# Altium project VM03.PrjPcb
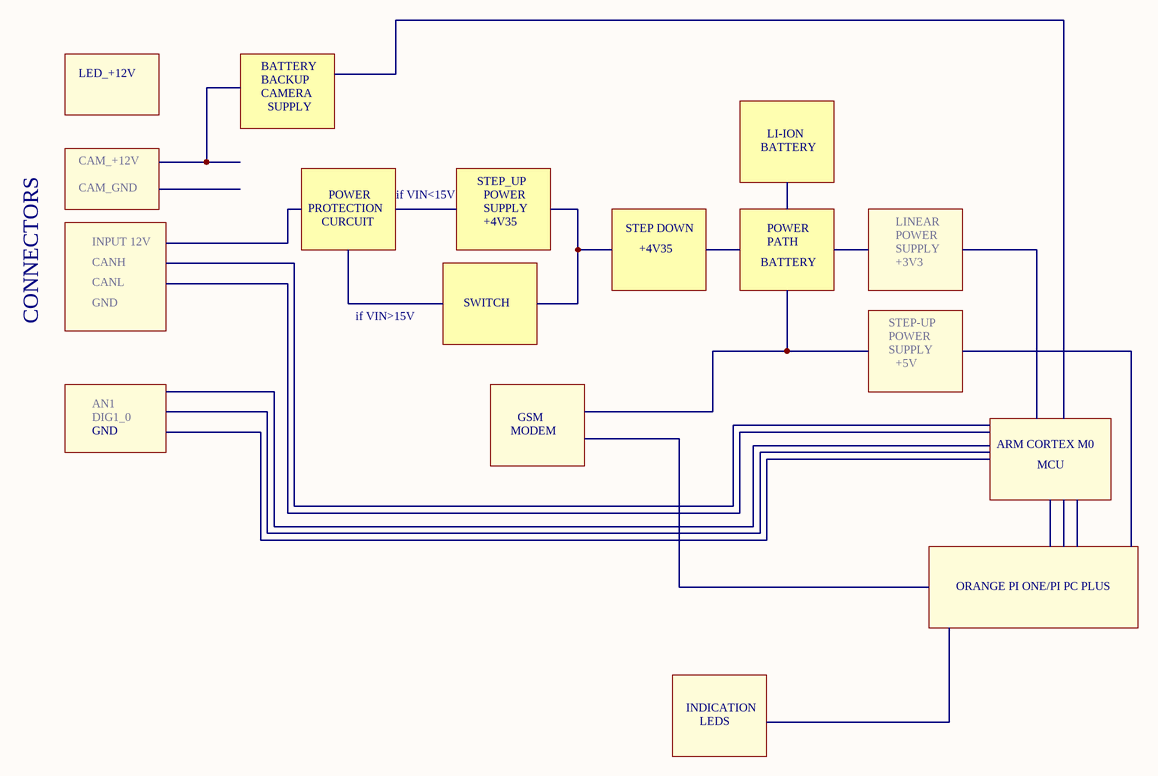
[diagram p0: [2]-BLOCK_DIAGRAM.SchDoc]
13 sheets, 186 parts. Net scope: flat (ports and power ports of the same name join across sheets).
Board file: VM03.PcbDoc
Sheets:
  [2]-BLOCK_DIAGRAM.SchDoc
  [3]-MCU_MAIN.SchDoc
  [4]-MCU_POWER.SchDoc
  [5]-OPI_MAIN.SchDoc
  [7]-GSM_MODEM_MAIN.SchDoc
  [9]-CAMERA_POWER_CONTROLLER.SchDoc
  [10]-MAIN_POWER.SchDoc
  [11]-MAIN_POWER2.SchDoc
  [11]-BATTERY_BACKUP.SchDoc
  [12]-MCU_INPUTS.SchDoc
  [13]-LED_INDICATION.SchDoc
  [14]-MAIN_CONNECTORS.SchDoc
  [16]-CLOCK.SchDoc

## Sheet [2]-BLOCK_DIAGRAM.SchDoc
size A4

### Notes on the sheet
- LED_+12V
- BATTERY
- BACKUP
- CAMERA
- CAM_+12V
- SUPPLY
- LI-ION
- CAM_GND
- PROTECTION
- CURCUIT
- POWER
- if VIN<15V
- STEP_UP
- +4V35
- STEP DOWN
- LINEAR
- INPUT 12V
- CANH
- CANL
- PATH
- +3V3
- CONNECTORS
- GND
- if VIN>15V
- SWITCH
- STEP-UP
- +5V
- AN1
- DIG1_0
- MODEM
- GSM
- ARM CORTEX M0
- MCU
- ORANGE PI ONE/PI PC PLUS
- INDICATION
- LEDS

## Sheet [3]-MCU_MAIN.SchDoc
size A4
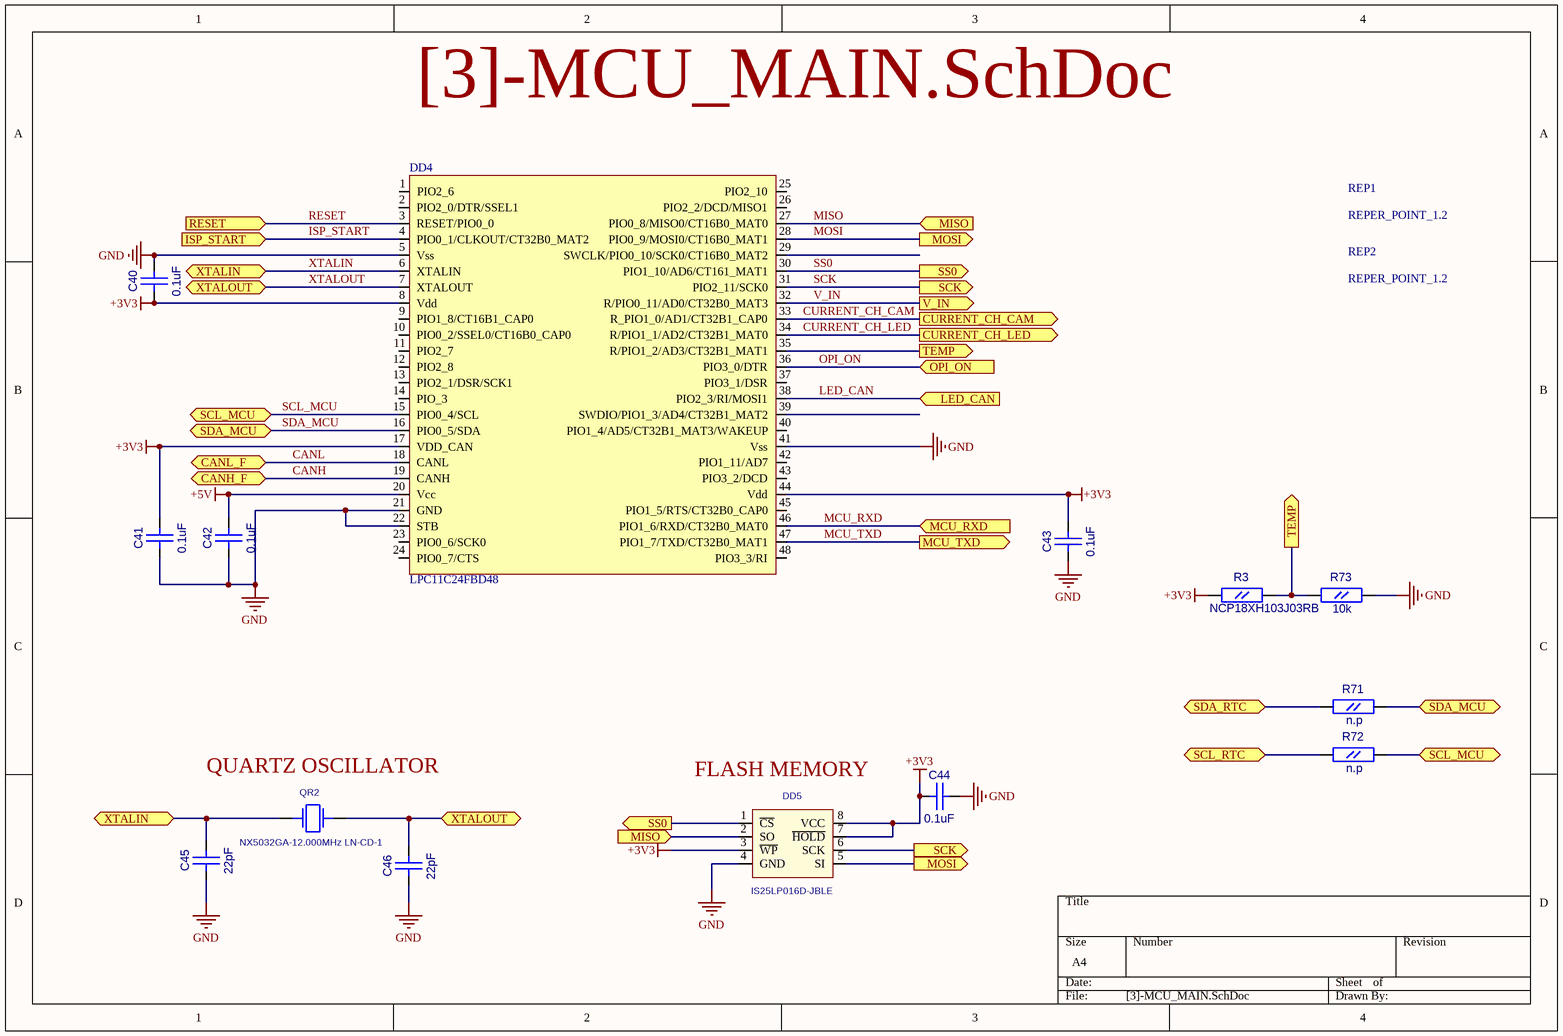
[diagram p1: [3]-MCU_MAIN.SchDoc]

### Parts
C40  0.1uF  [CC0603]
C41  0.1uF  [CC0603]
C42  0.1uF  [CC0603]
C43  0.1uF  [CC0603]
C44  0.1uF  [CC0603]
C45  22pF  [CC0603]
C46  22pF  [CC0603]
DD4  LPC11C24FBD48  [LQFP48]
DD5  IS25LP016D-JBLE  [EIAJ_SO8]
QR2  NX5032GA-12.000MHz LN-CD-1  [AC5032_2]
R3  NCP18XH103J03RB  [RC0603]
R71  n.p  [RC0603]
R72  n.p  [RC0603]
R73  10k  [RC0603]
REP1  REPER_POINT_1.2  [REPER1.2]
REP2  REPER_POINT_1.2  [REPER1.2]

### Ports
CANH_F (bidir), CANL_F (bidir), CURRENT_CH_CAM (out), CURRENT_CH_LED (out), ISP_START (in), LED_CAN (in), MCU_RXD (in), MCU_TXD (out), MISO (in), MOSI (out), OPI_ON (in), RESET (in), SCK (out), SCL_MCU (bidir), SCL_RTC (bidir), SDA_MCU (bidir), SDA_RTC (bidir), SS0 (out), TEMP (out), V_IN (out), XTALIN (bidir), XTALOUT (bidir)

### Nets
+3V3: C40.1(A) C41.2(B) C43.2(B) C44.1(A) DD4.8(Vdd) DD4.17(VDD_CAN) DD4.44(Vdd) DD5.3(~{WP}) DD5.7(~{HOLD}) DD5.8(VCC) R3.1(A)
+5V: C42.2(B) DD4.20(Vcc)
GND: C40.2(B) C41.1(A) C42.1(A) C43.1(A) C44.2(B) C45.1(A) C46.1(A) DD4.5(Vss) DD4.21(GND) DD4.22(STB) DD4.41(Vss) DD5.4(GND) R73.2(B)
CANH: DD4.19(CANH) ; port CANH_F
CANL: DD4.18(CANL) ; port CANL_F
CURRENT_CH_CAM: DD4.33(R_PIO1_0/AD1/CT32B1_CAP0) ; port CURRENT_CH_CAM
CURRENT_CH_LED: DD4.34(R/PIO1_1/AD2/CT32B1_MAT0) ; port CURRENT_CH_LED
ISP_START: DD4.4(PIO0_1/CLKOUT/CT32B0_MAT2) ; port ISP_START
LED_CAN: DD4.38(PIO2_3/RI/MOSI1) ; port LED_CAN
MCU_RXD: DD4.46(PIO1_6/RXD/CT32B0_MAT0) ; port MCU_RXD
MCU_TXD: DD4.47(PIO1_7/TXD/CT32B0_MAT1) ; port MCU_TXD
MISO: DD4.27(PIO0_8/MISO0/CT16B0_MAT0) DD5.2(SO) ; port MISO
MOSI: DD4.28(PIO0_9/MOSI0/CT16B0_MAT1) DD5.5(SI) ; port MOSI
OPI_ON: DD4.36(PIO3_0/DTR) ; port OPI_ON
RESET: DD4.3(RESET/PIO0_0) ; port RESET
SCK: DD4.31(PIO2_11/SCK0) DD5.6(SCK) ; port SCK
SCL_MCU: DD4.15(PIO0_4/SCL) R72.2(B) ; port SCL_MCU
SDA_MCU: DD4.16(PIO0_5/SDA) R71.2(B) ; port SDA_MCU
SS0: DD4.30(PIO1_10/AD6/CT161_MAT1) DD5.1(~{CS}) ; port SS0
V_IN: DD4.32(R/PIO0_11/AD0/CT32B0_MAT3) ; port V_IN
XTALIN: C45.2(B) DD4.6(XTALIN) QR2.1 ; port XTALIN
XTALOUT: C46.2(B) DD4.7(XTALOUT) QR2.2 ; port XTALOUT
NetDD3_5: R71.1(A) ; port SDA_RTC
NetDD3_6: R72.1(A) ; port SCL_RTC
NetDD4_35: DD4.35(R/PIO1_2/AD3/CT32B1_MAT1) R3.2(B) R73.1(A) ; port TEMP

Not connected (* = marked no-connect by the designer): DD4 1(PIO2_6) 2(PIO2_0/DTR/SSEL1) 9(PIO1_8/CT16B1_CAP0) 10(PIO0_2/SSEL0/CT16B0_CAP0) 11(PIO2_7) 12(PIO2_8) 13(PIO2_1/DSR/SCK1) 14(PIO_3) 23(PIO0_6/SCK0) 24(PIO0_7/CTS) 25(PIO2_10) 26(PIO2_2/DCD/MISO1) 29(SWCLK/PIO0_10/SCK0/CT16B0_MAT2) 37(PIO3_1/DSR) 39(SWDIO/PIO1_3/AD4/CT32B1_MAT2) 40(PIO1_4/AD5/CT32B1_MAT3/WAKEUP) 42(PIO1_11/AD7) 43(PIO3_2/DCD) 45(PIO1_5/RTS/CT32B0_CAP0) 48(PIO3_3/RI); REP1 1; REP2 1

### Notes on the sheet
- (near QR2) QUARTZ OSCILLATOR
- (near DD5) FLASH MEMORY

### Library data of the parts
C40-C46 = CC0603
  C40-C44: Value: 0.1uF
  C45 C46: Value: 22pF
DD5 = S25FL016A0LMFI01: Value: IS25LP016D-JBLE
QR2 = AC5032_2: AC5032/2; Value: NX5032GA-12.000MHz LN-CD-1
R3 R71-R73 = RC0603
  R3: Value: NCP18XH103J03RB
  R71 R72: Value: n.p
  R73: Value: 10k
REP1 REP2 = REPER1.2: Value: REPER_POINT_1.2
DD4 = LPC11C24FBD48: Value: LPC11C24FBD48

## Sheet [4]-MCU_POWER.SchDoc
size A4
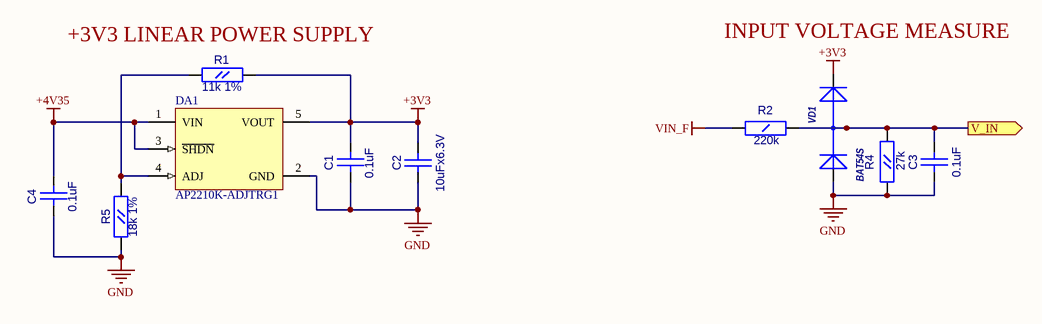
[diagram p2: [4]-MCU_POWER.SchDoc]

### Parts
C1  0.1uF  [CC0603]
C2  10uFx6.3V  [CC0805]
C3  0.1uF  [CC0603]
C4  0.1uF  [CC0603]
DA1  AP2210K-ADJTRG1  [SOT23-5]
R1  11k 1%  [RC0603]
R2  220k  [RC1206]
R4  27k  [RC0603]
R5  18k 1%  [RC0603]
VD1  BAT54S  [SOT-23(GSD)]

### Ports
V_IN (out)

### Nets
+3V3: C1.1(A) C2.2(B) DA1.5(VOUT) R1.2(B) VD1.2(K)
+4V35: C4.1(A) DA1.1(VIN) DA1.3(~{SHDN})
GND: C1.2(B) C2.1(A) C3.1(A) C4.2(B) DA1.2(GND) R4.1(A) R5.1(A) VD1.1(A)
VIN_F: R2.1(A)
V_IN: C3.2(B) R2.2(B) R4.2(B) VD1.3(AK) ; port V_IN
NetDA1_4: DA1.4(ADJ) R1.1(A) R5.2(B)

### Notes on the sheet
- (near R1) +3V3 LINEAR POWER SUPPLY
- (near VD1) INPUT VOLTAGE MEASURE

### Library data of the parts
C1 C3 C4 = CC0603: Value: 0.1uF
C2 = CC0805: Value: 10uFx6.3V
DA1 = MCP1824T-ADJE/OT: 300 mA, Low Voltage, Low Quiescent Current LDO Regulator, 5-Pin SOT-223, Extended Temperature, Tape and Reel; Published: 29-Jan-2009; DatasheetVersion: revA, Aug-2007; PackageVersion: revAW, Oct-2008; PackageReference: SOT-223-DC5; Publisher: Altium Limited; PackageDescription: 5-Lead Plastic Small Outline Transistor (DC) [SOT-223]; ComponentLink1Description: Manufacturer Link; ComponentLink1URL: http://www.microchip.com; ComponentLink2Description: Datasheet; ComponentLink2URL: http://ww1.microchip.com/downloads/en/DeviceDoc/22070a.pdf; ComponentLink3Description: Packaging Specification; ComponentLink3URL: http://ww1.microchip.com/downloads/en/PackagingSpec/00049AW.pdf
R1 R4 R5 = RC0603
  R1: Value: 11k 1%
  R4: Value: 27k
  R5: Value: 18k 1%
R2 = RC1206: Value: 220k
VD1 = BAT54S: 1.0 Ampere General Purpose Rectifier; ComponentField6: Published 8-Jun-2000, Modified 11-July-2000: SIM Model Added.; Value: *

## Sheet [5]-OPI_MAIN.SchDoc
size A4
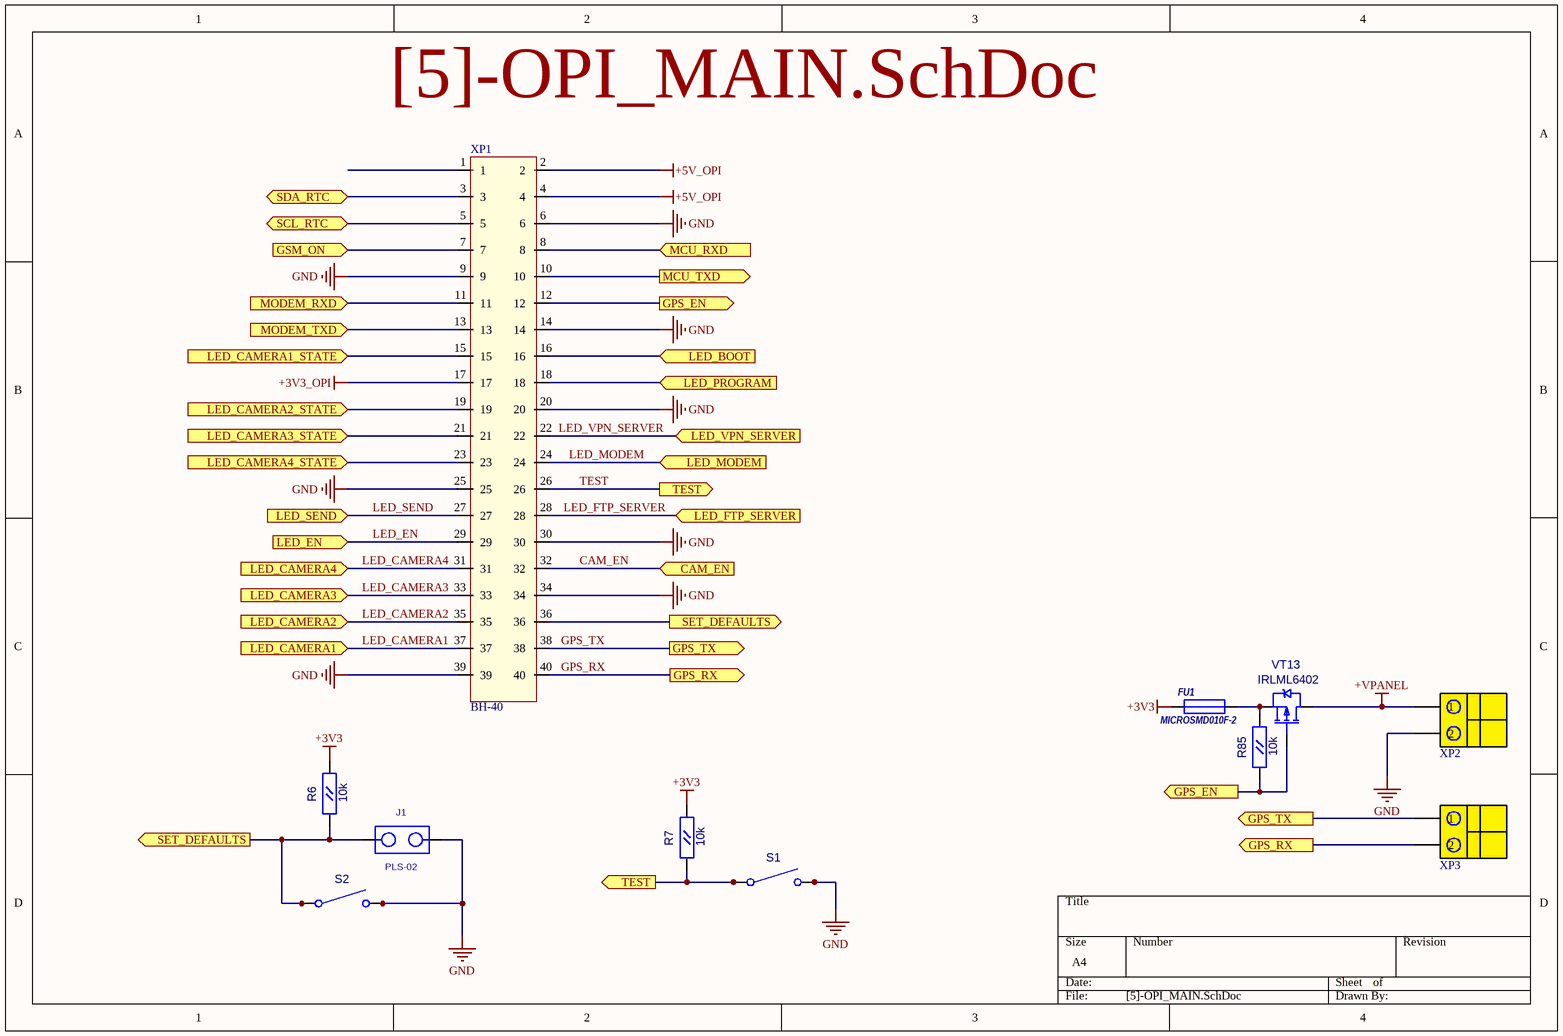
[diagram p3: [5]-OPI_MAIN.SchDoc]

### Parts
FU1  MICROSMD010F-2  [RC1210]
J1  PLS-02  [PLS-02]
R6  10k  [RC0603]
R7  10k  [RC0603]
R85  10k  [RC0603]
S1  DTSM-61N  [DTSM-61N]  (value not drawn)
S2  DTSM-61N  [DTSM-61N]  (value not drawn)
VT13  IRLML6402  [SOT-23(123)]
XP1  BH-40  [BH-40]
XP2  DG330-2P  [DG330-2P]  (value not drawn)
XP3  DG330-2P  [DG330-2P]  (value not drawn)

### Ports
CAM_EN (in), GPS_EN (out), GPS_RX (out), GPS_TX (out), GSM_ON (in), LED_BOOT (in), LED_CAMERA1 (in), LED_CAMERA1_STATE (in), LED_CAMERA2 (in), LED_CAMERA2_STATE (in), LED_CAMERA3 (in), LED_CAMERA3_STATE (in), LED_CAMERA4 (in), LED_CAMERA4_STATE (in), LED_EN (in), LED_FTP_SERVER (in), LED_MODEM (in), LED_PROGRAM (in), LED_SEND (in), LED_VPN_SERVER (in), MCU_RXD (in), MCU_TXD (out), MODEM_RXD (in), MODEM_TXD (in), SCL_RTC (bidir), SDA_RTC (bidir), SET_DEFAULTS (out), TEST (out)

### Nets
+3V3: FU1.1 R6.2(B) R7.2(B)
+3V3_OPI: XP1.17
+5V_OPI: XP1.2 XP1.4
+VPANEL: VT13.3(D) XP2.1
GND: J1.2 S1.3(C2) S1.4 S2.3(C2) S2.4 XP1.6 XP1.9 XP1.14 XP1.20 XP1.25 XP1.30 XP1.34 XP1.39 XP2.2
CAM_EN: XP1.32 ; port CAM_EN
GPS_RX: XP1.40 XP3.2 ; port GPS_RX
GPS_TX: XP1.38 XP3.1 ; port GPS_TX
LED_CAMERA1: XP1.37 ; port LED_CAMERA1
LED_CAMERA2: XP1.35 ; port LED_CAMERA2
LED_CAMERA3: XP1.33 ; port LED_CAMERA3
LED_CAMERA4: XP1.31 ; port LED_CAMERA4
LED_EN: XP1.29 ; port LED_EN
LED_FTP_SERVER: XP1.28 ; port LED_FTP_SERVER
LED_MODEM: XP1.24 ; port LED_MODEM
LED_SEND: XP1.27 ; port LED_SEND
LED_VPN_SERVER: XP1.22 ; port LED_VPN_SERVER
MCU_RXD: XP1.8 ; port MCU_RXD
MCU_TXD: XP1.10 ; port MCU_TXD
TEST: R7.1(A) S1.1(C1) S1.2 XP1.26 ; port TEST
NetDD3_5: XP1.3 ; port SDA_RTC
NetDD3_6: XP1.5 ; port SCL_RTC
NetFU1_2: FU1.2 R85.2(B) VT13.2(S)
NetJ1_1: J1.1 R6.1(A) S2.1(C1) S2.2 XP1.36 ; port SET_DEFAULTS
NetR15_2: XP1.7 ; port GSM_ON
NetR33_2: XP1.16 ; port LED_BOOT
NetR34_2: XP1.18 ; port LED_PROGRAM
NetR74_2: XP1.15 ; port LED_CAMERA1_STATE
NetR75_2: XP1.19 ; port LED_CAMERA2_STATE
NetR83_2: XP1.21 ; port LED_CAMERA3_STATE
NetR84_2: XP1.23 ; port LED_CAMERA4_STATE
NetR85_1: R85.1(A) VT13.1(G) XP1.12 ; port GPS_EN
NetXP1_11: XP1.11 ; port MODEM_RXD
NetXP1_13: XP1.13 ; port MODEM_TXD

Not connected (* = marked no-connect by the designer): XP1 1

### Library data of the parts
FU1 = MICROSMD: Value: *
R6 R7 R85 = RC0603: Value: 10k
S1 S2 = DTSM-61N: Switch, Single Pole, Single Throw, Normally Open; Value: {Value}
VT13 = IRLML6402: HEXFET Power MOSFET; OriginalName: IRLML5103; ComponentField7: Published 8-Jun-2000; Value: IRLML6402
XP1 = BH-40: 2.54mm connector with key; Value: BH-40
XP2 XP3 = DG330-2P: Degson 2 pin connector rear; Value: DG330-2P
J1 = PLS-02: Value: *

## Sheet [7]-GSM_MODEM_MAIN.SchDoc
size A4
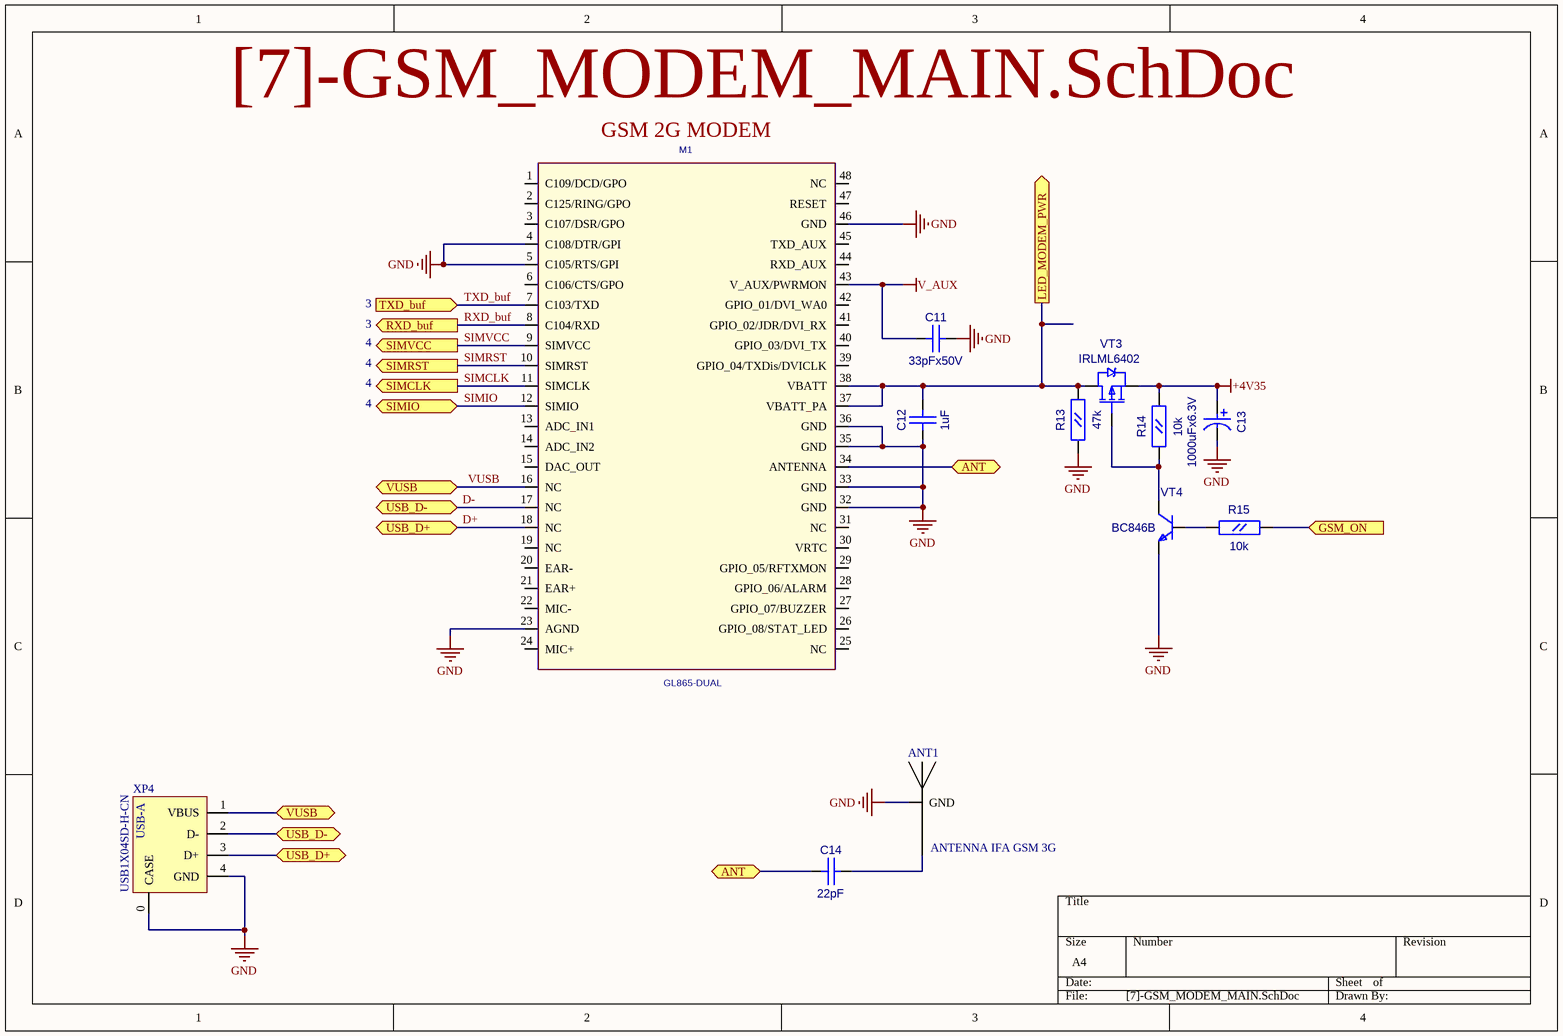
[diagram p4: [7]-GSM_MODEM_MAIN.SchDoc]

### Parts
ANT1  ANTENNA IFA GSM 3G  [IFA_GSM_3G]
C11  33pFx50V  [CC0603]
C12  1uF  [CC0603]
C13  value 1000uFx6.3V  [CC8X3.5]  (hidden comment: CAP0.35)
C14  22pF  [CC0603]
M1  GL865-DUAL  [GL868-DUAL]
R13  47k  [RC0603]
R14  10k  [RC0603]
R15  10k  [RC0603]
VT3  IRLML6402  [SOT-23(123)]
VT4  BC846B  [SOT-23(123)]
XP4  USB1X04SD-H-CN  [USB_A_FRONT]

### Ports
ANT (bidir), GSM_ON (in), LED_MODEM_PWR (out), RXD_buf (out), SIMCLK (out), SIMIO (bidir), SIMRST (out), SIMVCC (out), TXD_buf (in), USB_D+ (bidir), USB_D- (bidir), VUSB (bidir)

### Nets
+4V35: C13.1 R14.2(B) VT3.2(S)
GND: ANT1.2(GND) C11.2(B) C12.1(A) C13.2 M1.4(C108/DTR/GPI) M1.5(C105/RTS/GPI) M1.23(AGND) M1.32(GND) M1.33(GND) M1.35(GND) M1.36(GND) M1.46(GND) R13.1(A) VT4.2(E) XP4.0(CASE) XP4.4(GND)
V_AUX: C11.1(A) M1.43(V_AUX/PWRMON)
D+: M1.18(NC) XP4.3(D+) ; port USB_D+
D-: M1.17(NC) XP4.2(D-) ; port USB_D-
RXD_buf: M1.8(C104/RXD) ; port RXD_buf
SIMCLK: M1.11(SIMCLK) ; port SIMCLK
SIMIO: M1.12(SIMIO) ; port SIMIO
SIMRST: M1.10(SIMRST) ; port SIMRST
SIMVCC: M1.9(SIMVCC) ; port SIMVCC
TXD_buf: M1.7(C103/TXD) ; port TXD_buf
VUSB: M1.16(NC) XP4.1(VBUS) ; port VUSB
NetANT1_1: ANT1.1(RF_IN) C14.2(B)
NetC12_2: C12.2(B) M1.37(VBATT_PA) M1.38(VBATT) R13.2(B) VT3.3(D) ; port LED_MODEM_PWR
NetC14_1: C14.1(A) M1.34(ANTENNA) ; port ANT
NetR14_1: R14.1(A) VT3.1(G) VT4.3(C)
NetR15_1: R15.1(A) VT4.1(B)
NetR15_2: R15.2(B) ; port GSM_ON

Not connected (* = marked no-connect by the designer): M1 1(C109/DCD/GPO) 2(C125/RING/GPO) 3(C107/DSR/GPO) 6(C106/CTS/GPO) 13(ADC_IN1) 14(ADC_IN2) 15(DAC_OUT) 19(NC) 20(EAR-) 21(EAR+) 22(MIC-) 24(MIC+) 25(NC) 26(GPIO_08/STAT_LED) 27(GPIO_07/BUZZER) 28(GPIO_06/ALARM) 29(GPIO_05/RFTXMON) 30(VRTC) 31(NC) 39(GPIO_04/TXDis/DVICLK) 40(GPIO_03/DVI_TX) 41(GPIO_02/JDR/DVI_RX) 42(GPIO_01/DVI_WA0) 44(RXD_AUX) 45(TXD_AUX) 47(RESET) 48(NC)

### Notes on the sheet
- (near M1) GSM 2G MODEM
- 3
- 4
- (in symbol USB_A_VERTICAL) USB-A

### Library data of the parts
ANT1 = ANTENNA_IFA_GSM_3G: 1.6mm Er=4.4
C11 C12 C14 = CC0603
  C11: Value: 33pFx50V
  C12: Value: 1uF
  C14: Value: 22pF
M1 = GL868-DUAL: Value: *
R13-R15 = RC0603
  R13: Value: 47k
  R14 R15: Value: 10k
VT3 = IRLML6402: as VT13 on sheet [5]-OPI_MAIN; Value: IRLML6402
VT4 = BC846BLT1: ComponentField7: Published 29-Sep-2000; OriginalName: BC846BLT1; Value: BC846B
XP4 = USB_A_VERTICAL: Vertical USB connetctor,type A.THR; Value: USB1X04SD-H-CN

## Sheet [9]-CAMERA_POWER_CONTROLLER.SchDoc
size A4
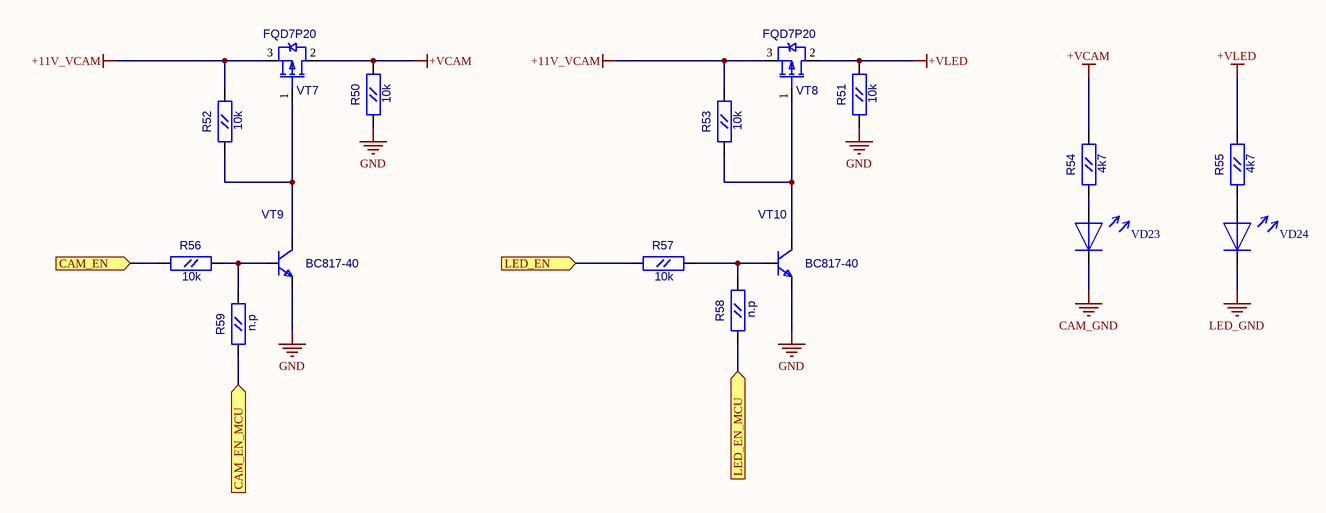
[diagram p5: [9]-CAMERA_POWER_CONTROLLER.SchDoc]

### Parts
R50  10k  [RC0603]
R51  10k  [RC0603]
R52  10k  [RC0603]
R53  10k  [RC0603]
R54  4k7  [RC0603]
R55  4k7  [RC0603]
R56  10k  [RC0603]
R57  10k  [RC0603]
R58  n.p  [RC0603]
R59  n.p  [RC0603]
VD23  LED_0805  [LED0805]  (value not drawn)
VD24  LED_0805  [LED0805]  (value not drawn)
VT7  FQD7P20  [D-PAK(TO-252AA)]
VT8  FQD7P20  [D-PAK(TO-252AA)]
VT9  BC817-40  [SOT-23(123)]
VT10  BC817-40  [SOT-23(123)]

### Ports
CAM_EN (in), CAM_EN_MCU (in), LED_EN (in), LED_EN_MCU (in)

### Nets
+11V_VCAM: R52.2(B) R53.2(B) VT7.3(S) VT8.3(S)
+VCAM: R50.2(B) R54.2(B) VT7.2(D)
+VLED: R51.2(B) R55.2(B) VT8.2(D)
CAM_GND: VD23.2
GND: R50.1(A) R51.1(A) VT9.2(E) VT10.2(E)
LED_GND: VD24.2
CAM_EN: R56.1(A) ; port CAM_EN
LED_EN: R57.1(A) ; port LED_EN
NetR52_1: R52.1(A) VT7.1(G) VT9.3(C)
NetR53_1: R53.1(A) VT8.1(G) VT10.3(C)
NetR54_1: R54.1(A) VD23.1
NetR55_1: R55.1(A) VD24.1
NetR56_2: R56.2(B) R59.2(B) VT9.1(B)
NetR57_2: R57.2(B) R58.2(B) VT10.1(B)
NetR58_1: R58.1(A) ; port LED_EN_MCU
NetR59_1: R59.1(A) ; port CAM_EN_MCU

### Library data of the parts
R50-R59 = RC0603
  R50-R53 R56 R57: Value: 10k
  R54 R55: Value: 4k7
  R58 R59: Value: n.p
VT7 VT8 = IRFR9220: HEXFET Power MOSFET; OriginalName: IRLML5103; ComponentField7: Published 8-Jun-2000; Value: FQD7P20
VT9 VT10 = BC846BLT1: NPN 500ma transistor; ComponentField7: Published 29-Sep-2000; OriginalName: BC846BLT1; Value: BC817-40
VD23 VD24 = LED_0805: Value: LED_0805

## Sheet [10]-MAIN_POWER.SchDoc
size A4
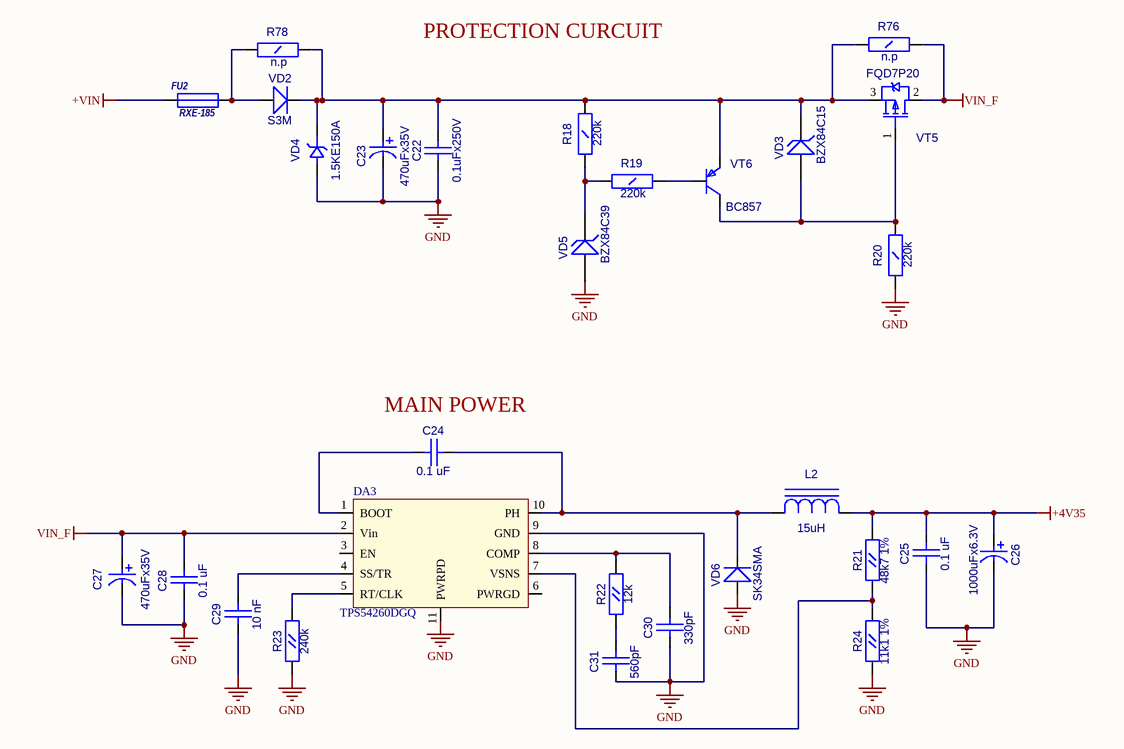
[diagram p6: [10]-MAIN_POWER.SchDoc]

### Parts
C22  0.1uFx250V  [CC1206]
C23  value 470uFx35V  [CC16X10_CAP0.5(1)(Primary)]  (hidden comment: CAP0.5(1))
C24  0.1 uF  [CC0603]
C25  0.1 uF  [CC0603]
C26  1000uFx6.3V  [CC8X3.5]
C27  470uFx35V  [CC16X10_CAP0.5(1)(Primary)]
C28  0.1 uF  [CC0603]
C29  10 nF  [CC0603]
C30  330pF  [CC0603]
C31  560pF  [CC0603]
DA3  TPS54260DGQ  [S-PDSO-G10]
FU2  RXE-185  [RXE-185]
L2  15uH  [SDR0805]
R18  220k  [RC1206]
R19  220k  [RC1206]
R20  220k  [RC1206]
R21  48k7 1%  [RC0603]
R22  12k  [RC0603]
R23  240k  [RC0603]
R24  11k1 1%  [RC0603]
R76  n.p  [RC1206]
R78  n.p  [RC1206]
VD2  S3M  [SMC]
VD3  BZX84C15  [SOT-23(123)]
VD4  1.5KE150A  [DO-201]
VD5  BZX84C39  [SOT-23(123)]
VD6  SK34SMA  [SMA]
VT5  FQD7P20  [D-PAK(TO-252AA)]
VT6  BC857  [SOT-23(123)]

### Nets
+4V35: C25.1(A) C26.1 L2.2(A) R21.2(B)
+VIN: FU2.1
GND: C22.1(A) C23.1 C25.2(B) C26.2 C27.1 C28.2(B) C29.2(B) C30.2(B) C31.2(B) DA3.9(GND) DA3.11(PWRPD) R20.1(A) R23.1(A) R24.1(A) VD4.1(A) VD5.1(A) VD6.1(A)
VIN_F: C27.2 C28.1(A) DA3.2(Vin) R76.2(B) VT5.2(D)
NetC22_2: C22.2(B) C23.2 R18.2(B) R76.1(A) R78.2(B) VD2.2(K) VD3.3(K) VD4.2(K) VT5.3(S) VT6.2(E)
NetC24_1: C24.1(A) DA3.10(PH) L2.1(C) VD6.2(K)
NetC24_2: C24.2(B) DA3.1(BOOT)
NetC29_1: C29.1(A) DA3.4(SS/TR)
NetC30_1: C30.1(A) DA3.8(COMP) R22.2(B)
NetC31_1: C31.1(A) R22.1(A)
NetDA3_5: DA3.5(RT/CLK) R23.2(B)
NetDA3_7: DA3.7(VSNS) R21.1(A) R24.2(B)
NetFU2_2: FU2.2 R78.1(A) VD2.1(A)
NetR18_1: R18.1(A) R19.1(A) VD5.3(K)
NetR19_2: R19.2(B) VT6.1(B)
NetR20_2: R20.2(B) VD3.1(A) VT5.1(G) VT6.3(C)

Not connected (* = marked no-connect by the designer): DA3 3(EN) 6(PWRGD)

### Notes on the sheet
- PROTECTION CURCUIT
- (near C24) MAIN POWER

### Library data of the parts
C22 = CC1206: Value: 0.1uFx250V
C24 C25 C28-C31 = CC0603
  C24 C25 C28: Value: 0.1 uF
  C29: Value: 10 nF
  C30: Value: 330pF
  C31: Value: 560pF
C26 = CAP0.35: Value: 1000uFx6.3V
C27 = CAP0.5(1): Value: 470uFx35V
L2 = SDR0805: Value: 15uH
R18-R20 R76 R78 = RC1206
  R18-R20: Value: 220k
  R76 R78: Value: n.p
R21-R24 = RC0603
  R21: Value: 48k7 1%
  R22: Value: 12k
  R23: Value: 240k
  R24: Value: 11k1 1%
VD2 = S3A: Schottky Rectifier; Value: S3M
VD3 VD5 = BZX84: Zener Voltage Regulator Diode
  VD3: Value: BZX84C15
  VD5: Value: BZX84C39
VD4 = 1.5KE: Value: 1.5KE150A
VD6 = SK34SMA: Schottky Rectifier; Value: {Value}
VT5 = IRFR9220: as VT7 on sheet [9]-CAMERA_POWER_CONTROLLER; Value: FQD7P20
VT6 = BC857B: PNP 100ma transistor; OriginalName: BC846BLT1; ComponentField7: Published 29-Sep-2000; Value: BC857
FU2 = RXE-185: Value: *

## Sheet [11]-MAIN_POWER2.SchDoc
size A4
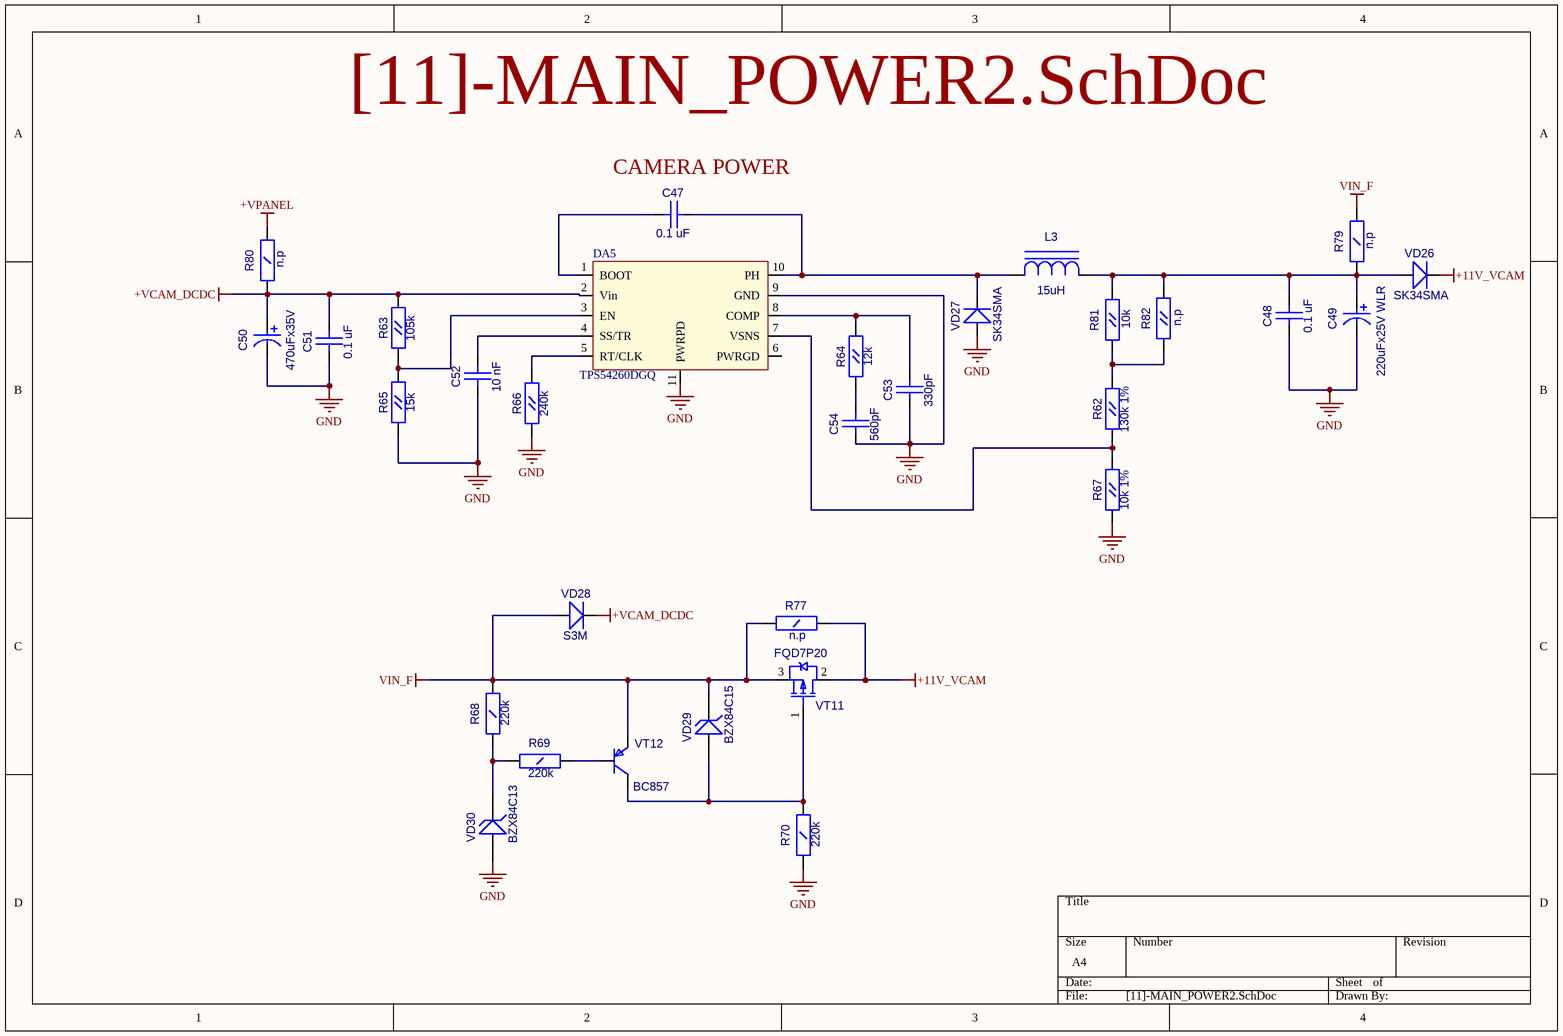
[diagram p7: [11]-MAIN_POWER2.SchDoc]

### Parts
C47  0.1 uF  [CC0603]
C48  0.1 uF  [CC0603]
C49  220uFx25V WLR  [CC8X3.5]
C50  470uFx35V  [CC16X10_CAP0.5(1)(Primary)]
C51  0.1 uF  [CC0603]
C52  10 nF  [CC0603]
C53  330pF  [CC0603]
C54  560pF  [CC0603]
DA5  TPS54260DGQ  [S-PDSO-G10]
L3  15uH  [SDR0805]
R62  130k 1%  [RC0603]
R63  105k  [RC0603]
R64  12k  [RC0603]
R65  15k  [RC0603]
R66  240k  [RC0603]
R67  10k 1%  [RC0603]
R68  220k  [RC1206]
R69  220k  [RC1206]
R70  220k  [RC1206]
R77  n.p  [RC1206]
R79  n.p  [RC1206]
R80  n.p  [RC1206]
R81  10k  [RC0603]
R82  n.p  [RC0603]
VD26  SK34SMA  [SMA]
VD27  SK34SMA  [SMA]
VD28  S3M  [SMC]
VD29  BZX84C15  [SOT-23(123)]
VD30  BZX84C13  [SOT-23(123)]
VT11  FQD7P20  [D-PAK(TO-252AA)]
VT12  BC857  [SOT-23(123)]

### Nets
+11V_VCAM: R77.2(B) VD26.2(K) VT11.2(D)
+VCAM_DCDC: C50.2 C51.1(A) DA5.2(Vin) R63.2(B) R80.1(A) VD28.2(K)
+VPANEL: R80.2(B)
GND: C48.2(B) C49.2 C50.1 C51.2(B) C52.2(B) C53.2(B) C54.2(B) DA5.9(GND) DA5.11(PWRPD) R65.1(A) R66.1(A) R67.1(A) R70.1(A) VD27.1(A) VD30.1(A)
VIN_F: R68.2(B) R77.1(A) R79.2(B) VD28.1(A) VD29.3(K) VT11.3(S) VT12.2(E)
NetC47_1: C47.1(A) DA5.10(PH) L3.1(C) VD27.2(K)
NetC47_2: C47.2(B) DA5.1(BOOT)
NetC48_1: C48.1(A) C49.1 L3.2(A) R79.1(A) R81.2(B) R82.2(B) VD26.1(A)
NetC52_1: C52.1(A) DA5.4(SS/TR)
NetC53_1: C53.1(A) DA5.8(COMP) R64.2(B)
NetC54_1: C54.1(A) R64.1(A)
NetDA5_3: DA5.3(EN) R63.1(A) R65.2(B)
NetDA5_5: DA5.5(RT/CLK) R66.2(B)
NetDA5_7: DA5.7(VSNS) R62.1(A) R67.2(B)
NetR62_2: R62.2(B) R81.1(A) R82.1(A)
NetR68_1: R68.1(A) R69.1(A) VD30.3(K)
NetR69_2: R69.2(B) VT12.1(B)
NetR70_2: R70.2(B) VD29.1(A) VT11.1(G) VT12.3(C)

Not connected (* = marked no-connect by the designer): DA5 6(PWRGD)

### Notes on the sheet
- (near C47) CAMERA POWER

### Library data of the parts
C47 C48 C51-C54 = CC0603
  C47 C48 C51: Value: 0.1 uF
  C52: Value: 10 nF
  C53: Value: 330pF
  C54: Value: 560pF
C49 = CAP0.35: Value: 220uFx25V WLR
C50 = CAP0.5(1): Value: 470uFx35V
L3 = SDR0805: Value: 15uH
R62-R67 R81 = RC0603
  R62: Value: 130k 1%
  R63: Value: 105k
  R64: Value: 12k
  R65: Value: 15k
  R66: Value: 240k
  R67: Value: 10k 1%
  R81: Value: 10k
R68-R70 R77 R79 R80 = RC1206
  R68-R70: Value: 220k
  R77 R79 R80: Value: n.p
R82 = RC0603: Component: NCP18XH103J03RB; Value: n.p
VD26 VD27 = SK34SMA: Schottky Rectifier; Value: {Value}
VD28 = S3A: Schottky Rectifier; Value: S3M
VD29 VD30 = BZX84: Zener Voltage Regulator Diode
  VD29: Value: BZX84C15
  VD30: Value: BZX84C13
VT11 = IRFR9220: as VT7 on sheet [9]-CAMERA_POWER_CONTROLLER; Value: FQD7P20
VT12 = BC857B: as VT6 on sheet [10]-MAIN_POWER; Value: BC857

## Sheet [11]-BATTERY_BACKUP.SchDoc
size A4
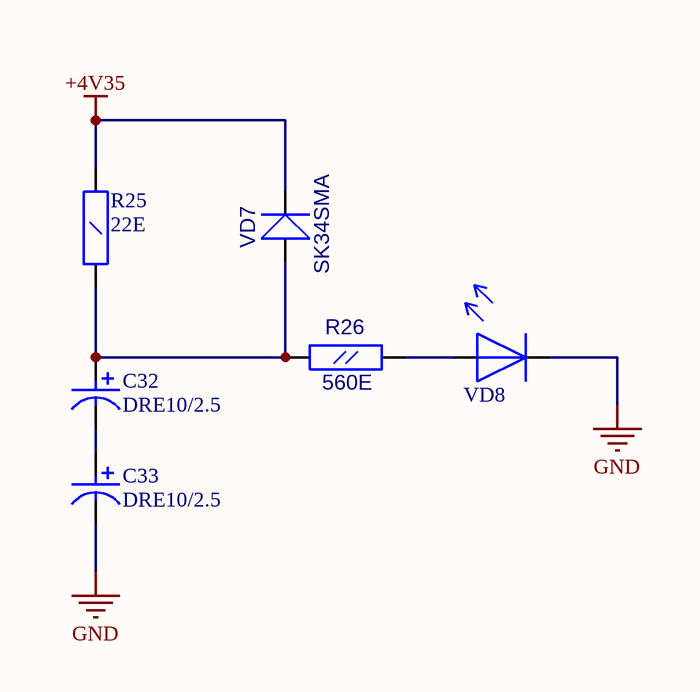
[diagram p8: [11]-BATTERY_BACKUP.SchDoc]

### Parts
C32  DRE10/2.5  [CAP_D12.5_H25]
C33  DRE10/2.5  [CAP_D12.5_H25]
R25  22E  [R2512]
R26  560E  [RC0603]
VD7  SK34SMA  [SMA]
VD8  LED_0805  [LED0805]  (value not drawn)

### Nets
+4V35: R25.2(B) VD7.2(K)
GND: C33.1 VD8.2
NetC32_1: C32.1 C33.2
NetC32_2: C32.2 R25.1(A) R26.1(A) VD7.1(A)
NetR26_2: R26.2(B) VD8.1

### Library data of the parts
C32 C33 = SUPERCAP_10F: Value: DRE10/2.5
R25 = RC2512: Resistor 2512 1W; Value: 22E
R26 = RC0603: Value: 560E
VD7 = SK34SMA: Schottky Rectifier; Value: {Value}
VD8 = LED_0805: Value: LED_0805

## Sheet [12]-MCU_INPUTS.SchDoc
size A4
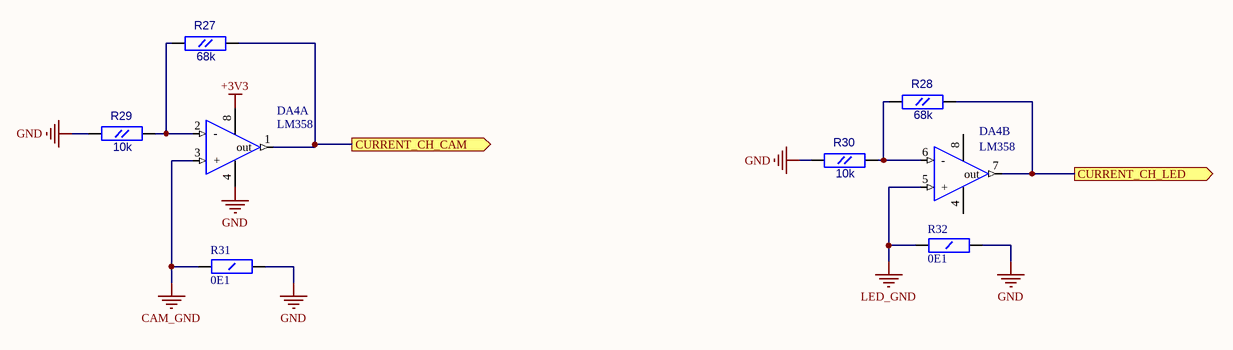
[diagram p9: [12]-MCU_INPUTS.SchDoc]

### Parts
DA4  LM358  [SO-8]  (parts A,B of 2)
R27  68k  [RC0603]
R28  68k  [RC0603]
R29  10k  [RC0603]
R30  10k  [RC0603]
R31  0E1  [R2512]
R32  0E1  [R2512]

### Ports
CURRENT_CH_CAM (out), CURRENT_CH_LED (out)

### Nets
+3V3: DA4.8(V+)
CAM_GND: DA4.3(+) R31.1(A)
GND: DA4.4(V-) R29.1(A) R30.1(A) R31.2(B) R32.2(B)
LED_GND: DA4.5(+) R32.1(A)
CURRENT_CH_CAM: DA4.1(out) R27.2(B) ; port CURRENT_CH_CAM
CURRENT_CH_LED: DA4.7(out) R28.2(B) ; port CURRENT_CH_LED
NetDA4_2: DA4.2(-) R27.1(A) R29.2(B)
NetDA4_6: DA4.6(-) R28.1(A) R30.2(B)

### Library data of the parts
R27-R30 = RC0603
  R27 R28: Value: 68k
  R29 R30: Value: 10k
R31 R32 = RC2512: Resistor 2512 1W; Value: 0E1
DA4 = lm358: Value: LM358

## Sheet [13]-LED_INDICATION.SchDoc
size A4
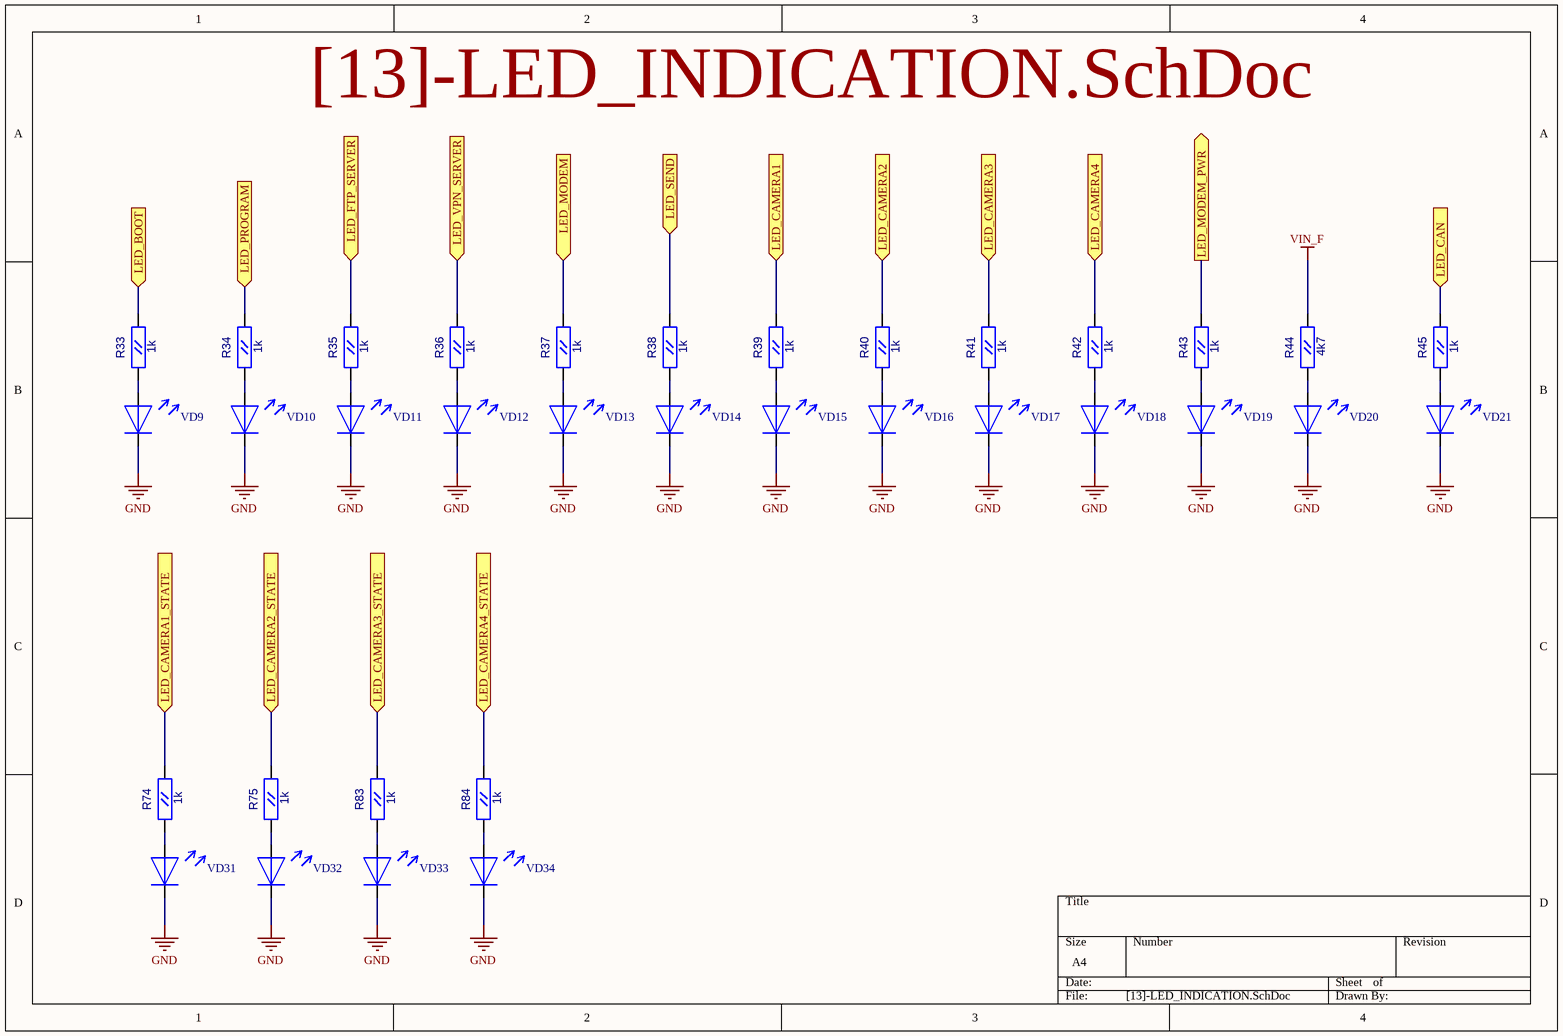
[diagram p10: [13]-LED_INDICATION.SchDoc]

### Parts
R33  1k  [RC0603]
R34  1k  [RC0603]
R35  1k  [RC0603]
R36  1k  [RC0603]
R37  1k  [RC0603]
R38  1k  [RC0603]
R39  1k  [RC0603]
R40  1k  [RC0603]
R41  1k  [RC0603]
R42  1k  [RC0603]
R43  1k  [RC0603]
R44  4k7  [RC0603]
R45  1k  [RC0603]
R74  1k  [RC0603]
R75  1k  [RC0603]
R83  1k  [RC0603]
R84  1k  [RC0603]
VD9  LED_0805  [LED0805]  (value not drawn)
VD10  LED_0805  [LED0805]  (value not drawn)
VD11  LED_0805  [LED0805]  (value not drawn)
VD12  LED_0805  [LED0805]  (value not drawn)
VD13  LED_0805  [LED0805]  (value not drawn)
VD14  LED_0805  [LED0805]  (value not drawn)
VD15  LED_0805  [LED0805]  (value not drawn)
VD16  LED_0805  [LED0805]  (value not drawn)
VD17  LED_0805  [LED0805]  (value not drawn)
VD18  LED_0805  [LED0805]  (value not drawn)
VD19  LED_0805  [LED0805]  (value not drawn)
VD20  LED_0805  [LED0805]  (value not drawn)
VD21  LED_0805  [LED0805]  (value not drawn)
VD31  LED_0805  [LED0805]  (value not drawn)
VD32  LED_0805  [LED0805]  (value not drawn)
VD33  LED_0805  [LED0805]  (value not drawn)
VD34  LED_0805  [LED0805]  (value not drawn)

### Ports
LED_BOOT (in), LED_CAMERA1 (in), LED_CAMERA1_STATE (in), LED_CAMERA2 (in), LED_CAMERA2_STATE (in), LED_CAMERA3 (in), LED_CAMERA3_STATE (in), LED_CAMERA4 (in), LED_CAMERA4_STATE (in), LED_CAN (in), LED_FTP_SERVER (in), LED_MODEM (in), LED_MODEM_PWR (out), LED_PROGRAM (in), LED_SEND (in), LED_VPN_SERVER (in)

### Nets
GND: VD9.2 VD10.2 VD11.2 VD12.2 VD13.2 VD14.2 VD15.2 VD16.2 VD17.2 VD18.2 VD19.2 VD20.2 VD21.2 VD31.2 VD32.2 VD33.2 VD34.2
VIN_F: R44.2(B)
LED_CAMERA1: R39.2(B) ; port LED_CAMERA1
LED_CAMERA2: R40.2(B) ; port LED_CAMERA2
LED_CAMERA3: R41.2(B) ; port LED_CAMERA3
LED_CAMERA4: R42.2(B) ; port LED_CAMERA4
LED_CAN: R45.2(B) ; port LED_CAN
LED_FTP_SERVER: R35.2(B) ; port LED_FTP_SERVER
LED_MODEM: R37.2(B) ; port LED_MODEM
LED_SEND: R38.2(B) ; port LED_SEND
LED_VPN_SERVER: R36.2(B) ; port LED_VPN_SERVER
NetC12_2: R43.2(B) ; port LED_MODEM_PWR
NetR33_1: R33.1(A) VD9.1
NetR33_2: R33.2(B) ; port LED_BOOT
NetR34_1: R34.1(A) VD10.1
NetR34_2: R34.2(B) ; port LED_PROGRAM
NetR35_1: R35.1(A) VD11.1
NetR36_1: R36.1(A) VD12.1
NetR37_1: R37.1(A) VD13.1
NetR38_1: R38.1(A) VD14.1
NetR39_1: R39.1(A) VD15.1
NetR40_1: R40.1(A) VD16.1
NetR41_1: R41.1(A) VD17.1
NetR42_1: R42.1(A) VD18.1
NetR43_1: R43.1(A) VD19.1
NetR44_1: R44.1(A) VD20.1
NetR45_1: R45.1(A) VD21.1
NetR74_1: R74.1(A) VD31.1
NetR74_2: R74.2(B) ; port LED_CAMERA1_STATE
NetR75_1: R75.1(A) VD32.1
NetR75_2: R75.2(B) ; port LED_CAMERA2_STATE
NetR83_1: R83.1(A) VD33.1
NetR83_2: R83.2(B) ; port LED_CAMERA3_STATE
NetR84_1: R84.1(A) VD34.1
NetR84_2: R84.2(B) ; port LED_CAMERA4_STATE

### Library data of the parts
R33-R45 R74 R75 R83 R84 = RC0603
  R33-R43 R45 R74 R75 R83 R84: Value: 1k
  R44: Value: 4k7
VD9-VD21 VD31-VD34 = LED_0805: Value: LED_0805

## Sheet [14]-MAIN_CONNECTORS.SchDoc
size A4
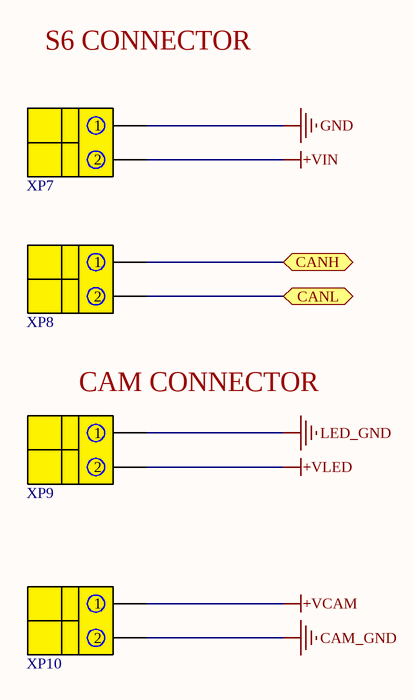
[diagram p11: [14]-MAIN_CONNECTORS.SchDoc]

### Parts
XP7  DG330-2P  [DG330-2P]  (value not drawn)
XP8  DG330-2P  [DG330-2P]  (value not drawn)
XP9  DG330-2P  [DG330-2P]  (value not drawn)
XP10  DG330-2P  [DG330-2P]  (value not drawn)

### Ports
CANH (bidir), CANL (bidir)

### Nets
+VCAM: XP10.1
+VIN: XP7.2
+VLED: XP9.2
CAM_GND: XP10.2
GND: XP7.1
LED_GND: XP9.1
NetXP8_1: XP8.1 ; port CANH
NetXP8_2: XP8.2 ; port CANL

### Notes on the sheet
- (near XP7) S6 CONNECTOR
- (near XP9) CAM CONNECTOR

### Library data of the parts
XP7-XP10 = DG330-2P: Degson 2 pin connector rear; Value: DG330-2P

## Sheet [16]-CLOCK.SchDoc
size A4
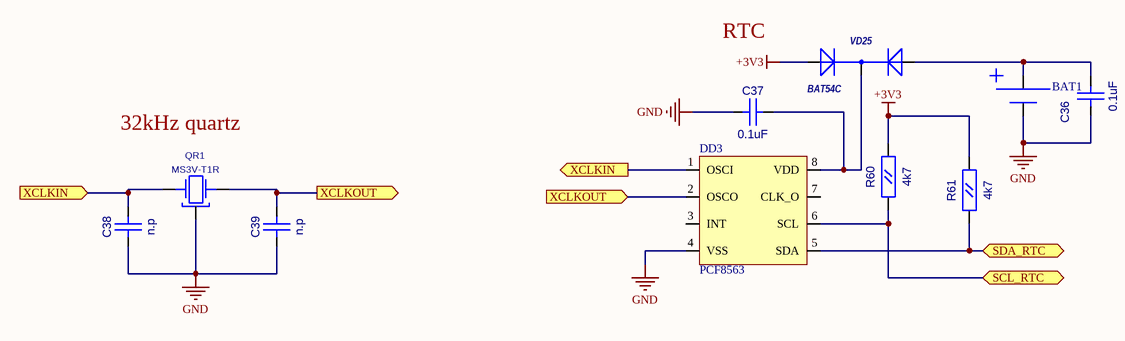
[diagram p12: [16]-CLOCK.SchDoc]

### Parts
BAT1  CR2032-VBY4  [CR2032_ONBOARD]  (value not drawn)
C36  0.1uF  [CC0603]
C37  0.1uF  [CC0603]
C38  n.p  [CC0603]
C39  n.p  [CC0603]
DD3  PCF8563  [SO-8]
QR1  MS3V-T1R  [MS3V-T1R]
R60  4k7  [RC0603]
R61  4k7  [RC0603]
VD25  BAT54C  [SOT-23(123)]

### Ports
SCL_RTC (bidir), SDA_RTC (bidir), XCLKIN (in), XCLKIN (out), XCLKOUT (in), XCLKOUT (out)

### Nets
+3V3: R60.2(B) R61.2(B) VD25.1(A)
GND: BAT1.1 C36.1(A) C37.1(A) C38.1(A) C39.1(A) DD3.4(VSS) QR1.3
NetBAT1_2: BAT1.2 C36.2(B) VD25.2(A)
NetC37_2: C37.2(B) DD3.8(VDD) VD25.3(K)
NetC38_2: C38.2(B) DD3.1(OSCI) QR1.2(X2) ; port XCLKIN
NetC39_2: C39.2(B) DD3.2(OSCO) QR1.1(X1) ; port XCLKOUT
NetDD3_5: DD3.5(SDA) R61.1(A) ; port SDA_RTC
NetDD3_6: DD3.6(SCL) R60.1(A) ; port SCL_RTC

Not connected (* = marked no-connect by the designer): DD3 3(INT) 7(CLK_O)

### Notes on the sheet
- RTC
- 32kHz quartz

### Library data of the parts
BAT1 = CR2032-VBY2: Value: CR2032-VBY4
C36-C39 = CC0603
  C36 C37: Value: 0.1uF
  C38 C39: Value: n.p
QR1 = MS3V-T1R: CRYSTAL_32768 Hz; Value: MS3V-T1R
R60 R61 = RC0603: Value: 4k7
DD3 = PCF8563: Value: PCF8563
VD25 = BAT54C: Value: *

## Nets that join several sheets
+3V3: [3]-MCU_MAIN (11 pins), [4]-MCU_POWER (5 pins), [5]-OPI_MAIN (FU1.1 R6.2 R7.2), [12]-MCU_INPUTS (DA4.8), [16]-CLOCK (R60.2 R61.2 VD25.1)
+4V35: [4]-MCU_POWER (C4.1 DA1.1 DA1.3), [7]-GSM_MODEM_MAIN (C13.1 R14.2 VT3.2), [10]-MAIN_POWER (C25.1 C26.1 L2.2 R21.2), [11]-BATTERY_BACKUP (R25.2 VD7.2)
+11V_VCAM: [9]-CAMERA_POWER_CONTROLLER (R52.2 R53.2 VT7.3 VT8.3), [11]-MAIN_POWER2 (R77.2 VD26.2 VT11.2)
+VCAM: [9]-CAMERA_POWER_CONTROLLER (R50.2 R54.2 VT7.2), [14]-MAIN_CONNECTORS (XP10.1)
+VIN: [10]-MAIN_POWER (FU2.1), [14]-MAIN_CONNECTORS (XP7.2)
+VLED: [9]-CAMERA_POWER_CONTROLLER (R51.2 R55.2 VT8.2), [14]-MAIN_CONNECTORS (XP9.2)
+VPANEL: [5]-OPI_MAIN (VT13.3 XP2.1), [11]-MAIN_POWER2 (R80.2)
CAM_GND: [9]-CAMERA_POWER_CONTROLLER (VD23.2), [12]-MCU_INPUTS (DA4.3 R31.1), [14]-MAIN_CONNECTORS (XP10.2)
GND: [3]-MCU_MAIN (13 pins), [4]-MCU_POWER (8 pins), [5]-OPI_MAIN (14 pins), [7]-GSM_MODEM_MAIN (16 pins), [9]-CAMERA_POWER_CONTROLLER (R50.1 R51.1 VT9.2 VT10.2), [10]-MAIN_POWER (17 pins), [11]-MAIN_POWER2 (15 pins), [11]-BATTERY_BACKUP (C33.1 VD8.2), [12]-MCU_INPUTS (5 pins), [13]-LED_INDICATION (17 pins), [14]-MAIN_CONNECTORS (XP7.1), [16]-CLOCK (7 pins)
LED_GND: [9]-CAMERA_POWER_CONTROLLER (VD24.2), [12]-MCU_INPUTS (DA4.5 R32.1), [14]-MAIN_CONNECTORS (XP9.1)
VIN_F: [4]-MCU_POWER (R2.1), [10]-MAIN_POWER (5 pins), [11]-MAIN_POWER2 (7 pins), [13]-LED_INDICATION (R44.2)
CAM_EN: [5]-OPI_MAIN (XP1.32), [9]-CAMERA_POWER_CONTROLLER (R56.1)
CURRENT_CH_CAM: [3]-MCU_MAIN (DD4.33), [12]-MCU_INPUTS (DA4.1 R27.2)
CURRENT_CH_LED: [3]-MCU_MAIN (DD4.34), [12]-MCU_INPUTS (DA4.7 R28.2)
LED_CAMERA1: [5]-OPI_MAIN (XP1.37), [13]-LED_INDICATION (R39.2)
LED_CAMERA2: [5]-OPI_MAIN (XP1.35), [13]-LED_INDICATION (R40.2)
LED_CAMERA3: [5]-OPI_MAIN (XP1.33), [13]-LED_INDICATION (R41.2)
LED_CAMERA4: [5]-OPI_MAIN (XP1.31), [13]-LED_INDICATION (R42.2)
LED_CAN: [3]-MCU_MAIN (DD4.38), [13]-LED_INDICATION (R45.2)
LED_EN: [5]-OPI_MAIN (XP1.29), [9]-CAMERA_POWER_CONTROLLER (R57.1)
LED_FTP_SERVER: [5]-OPI_MAIN (XP1.28), [13]-LED_INDICATION (R35.2)
LED_MODEM: [5]-OPI_MAIN (XP1.24), [13]-LED_INDICATION (R37.2)
LED_SEND: [5]-OPI_MAIN (XP1.27), [13]-LED_INDICATION (R38.2)
LED_VPN_SERVER: [5]-OPI_MAIN (XP1.22), [13]-LED_INDICATION (R36.2)
MCU_RXD: [3]-MCU_MAIN (DD4.46), [5]-OPI_MAIN (XP1.8)
MCU_TXD: [3]-MCU_MAIN (DD4.47), [5]-OPI_MAIN (XP1.10)
NetC12_2: [7]-GSM_MODEM_MAIN (5 pins), [13]-LED_INDICATION (R43.2)
NetDD3_5: [3]-MCU_MAIN (R71.1), [5]-OPI_MAIN (XP1.3), [16]-CLOCK (DD3.5 R61.1)
NetDD3_6: [3]-MCU_MAIN (R72.1), [5]-OPI_MAIN (XP1.5), [16]-CLOCK (DD3.6 R60.1)
NetR15_2: [5]-OPI_MAIN (XP1.7), [7]-GSM_MODEM_MAIN (R15.2)
NetR33_2: [5]-OPI_MAIN (XP1.16), [13]-LED_INDICATION (R33.2)
NetR34_2: [5]-OPI_MAIN (XP1.18), [13]-LED_INDICATION (R34.2)
NetR74_2: [5]-OPI_MAIN (XP1.15), [13]-LED_INDICATION (R74.2)
NetR75_2: [5]-OPI_MAIN (XP1.19), [13]-LED_INDICATION (R75.2)
NetR83_2: [5]-OPI_MAIN (XP1.21), [13]-LED_INDICATION (R83.2)
NetR84_2: [5]-OPI_MAIN (XP1.23), [13]-LED_INDICATION (R84.2)
V_IN: [3]-MCU_MAIN (DD4.32), [4]-MCU_POWER (C3.2 R2.2 R4.2 VD1.3)